# EAGLE design PCB0007_SW18AB (EAGLE 9.7.0)
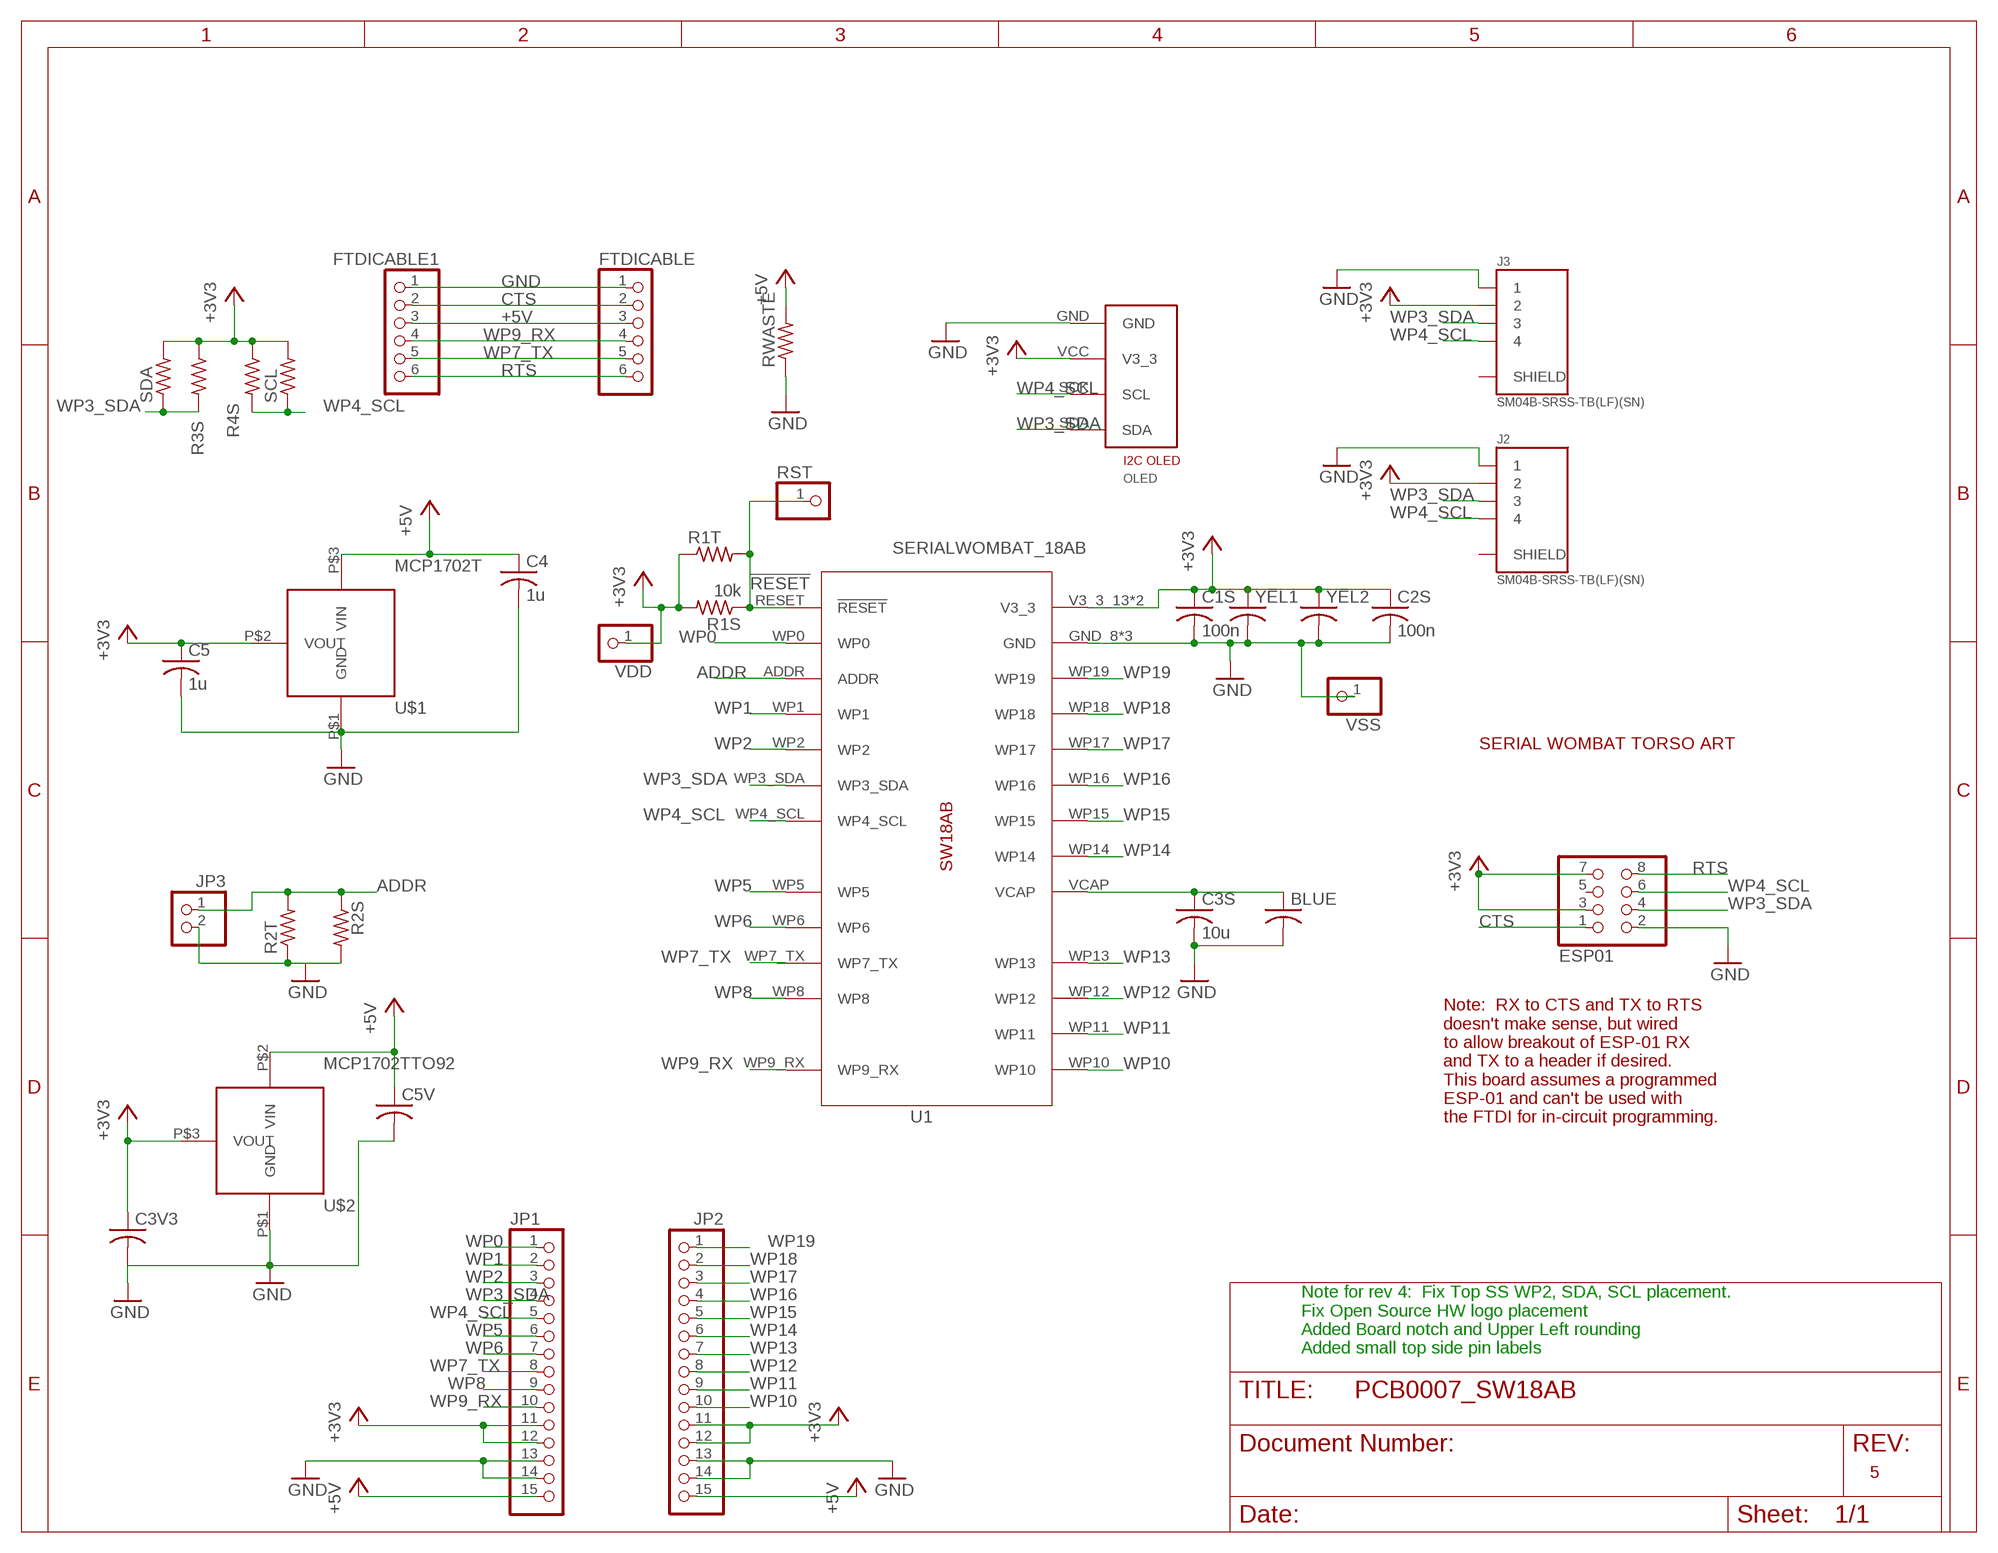
[diagram p0: schematic, sheet 1]

## Parts
BLUE  C-US025-030X050  [C025-030X050]
C1S  100n  C-USC0603  [C0603]
C2S  100n  C-USC0603  [C0603]
C3S  10u  C-USC0805  [C0805]
C3V3  C-US025-030X050  [C025-030X050]
C4  1u  C-USC0603  [C0603]
C5  1u  C-USC0603  [C0603]
C5V  C-US025-030X050  [C025-030X050]
ESP01  PINHD-2X4  [2X04]
FTDICABLE  PINHD-1X6  [1X06]
FTDICABLE1  PINHD-1X6  [1X06]
J2  SM04B-SRSS-TB(LF)(SN)  [JST_SM04B-SRSS-TB(LF)(SN)]
J3  SM04B-SRSS-TB(LF)(SN)  [JST_SM04B-SRSS-TB(LF)(SN)]
JP1  PINHD-1X15  [1X15]
JP2  PINHD-1X15  [1X15]
JP3  PINHD-1X2  [1X02]
OLED  OLED_I2C  [I2C_GND_VCC_SCL_SDA]
R1S  10k  R-US_R0603  [R0603]
R1T  R-US_0207/12  [0207/12]
R2S  R-US_R0603  [R0603]
R2T  R-US_0207/12  [0207/12]
R3S  R-US_R0603  [R0603]
R4S  R-US_R0603  [R0603]
RST  PINHD-1X1  [1X01]
RWASTE  R-US_R1206  [R1206]
SCL  R-US_0207/12  [0207/12]
SDA  R-US_0207/12  [0207/12]
U1  SERIALWOMBAT_18AB  [SW18AB_DIP]
U$1  MCP1702T  [SOT_23A_MICROCHIP]
U$2  MCP1702TTO92  [TO-92]
U$3  ART_SERIAL_WOMBAT_TORSO.33INHIGH  [ART_SERIAL_WOMBAT_TORSO_THIRDINCH]
VDD  PINHD-1X1  [1X01]
VSS  PINHD-1X1  [1X01]
YEL1  C-US025-030X050  [C025-030X050]
YEL2  C-US025-030X050  [C025-030X050]

## Nets
!RESET: R1S.1 R1T.2 RST.1 U1.RESET(!RESET)
+3V3: C1S.1 C2S.1 C3V3.1 C5.1 ESP01.3 ESP01.7 J2.2 J3.2 JP1.11 JP1.12 JP2.11 JP2.12 OLED.VCC(V3_3) R1S.2 R1T.1 R3S.1 R4S.1 SCL.2 SDA.2 U1.V3_3_13(V3_3) U1.V3_3_28(V3_3) U$1.P$2(VOUT) U$2.P$3(VOUT) VDD.1 YEL1.1 YEL2.1
+5V: C4.1 C5V.1 FTDICABLE1.3 FTDICABLE.3 JP1.15 JP2.15 RWASTE.2 U$1.P$3(VIN) U$2.P$2(VIN)
ADDR: JP3.1 R2S.1 R2T.2 U1.ADDR
CTS: ESP01.1 FTDICABLE1.2 FTDICABLE.2
GND: BLUE.2 C1S.2 C2S.2 C3S.2 C3V3.2 C4.2 C5.2 C5V.2 ESP01.2 FTDICABLE1.1 FTDICABLE.1 J2.1 J3.1 JP1.13 JP1.14 JP2.13 JP2.14 JP3.2 OLED.GND R2S.2 R2T.1 RWASTE.1 U1.G_19(GND) U1.G_27(GND) U1.GND_8(GND) U$1.P$1(GND) U$2.P$1(GND) VSS.1 YEL1.2 YEL2.2
N$1: BLUE.1 C3S.1 U1.VCAP
RTS: ESP01.8 FTDICABLE1.6 FTDICABLE.6
WP0: JP1.1 U1.WP0
WP1: JP1.2 U1.WP1
WP2: JP1.3 U1.WP2
WP3_SDA: ESP01.4 J2.3 J3.3 JP1.4 OLED.SDA R3S.2 SDA.1 U1.WP3_SDA
WP4_SCL: ESP01.6 J2.4 J3.4 JP1.5 OLED.SCK(SCL) R4S.2 SCL.1 U1.WP4_SCL
WP5: JP1.6 U1.WP5
WP6: JP1.7 U1.WP6
WP7_TX: FTDICABLE1.5 FTDICABLE.5 JP1.8 U1.WP7_TX
WP8: JP1.9 U1.WP8
WP9_RX: FTDICABLE1.4 FTDICABLE.4 JP1.10 U1.WP9_RX
WP10: JP2.10 U1.WP10
WP11: JP2.9 U1.WP11
WP12: JP2.8 U1.WP12
WP13: JP2.7 U1.WP13
WP14: JP2.6 U1.WP14
WP15: JP2.5 U1.WP15
WP16: JP2.4 U1.WP16
WP17: JP2.3 U1.WP17
WP18: JP2.2 U1.WP18
WP19: JP2.1 U1.WP19
Unconnected: ESP01.5 J2.S1(SHIELD) J2.S2(SHIELD) J3.S1(SHIELD) J3.S2(SHIELD)

## Notes on the sheet
- Note:  RX to CTS and TX to RTS 
  doesn't make sense, but wired 
  to allow breakout of ESP-01 RX 
  and TX to a header if desired.
  This board assumes a programmed
  ESP-01 and can't be used with
  the FTDI for in-circuit programming.
- Note for rev 4:  Fix Top SS WP2, SDA, SCL placement.  
  Fix Open Source HW logo placement
  Added Board notch and Upper Left rounding
  Added small top side pin labels
- 5

## Library data of the parts
BLUE C1S C2S C3S C3V3 C4 C5 C5V YEL1 YEL2 = rcl:C-US: CAPACITOR, American symbol; SPICEPREFIX: C
ESP01 = pinhead:PINHD-2X4: PIN HEADER
FTDICABLE FTDICABLE1 = pinhead:PINHD-1X6: PIN HEADER
J2 J3 = SerialWombat_F360_Library:SM04B-SRSS-TB(LF)(SN): SH Series 1.0 mm Pitch 2 Position Single Row Side Entry Shrouded Header; MANUFACTURER: JST; STANDARD: Manufacturer recommendations
JP1 JP2 = pinhead:PINHD-1X15: PIN HEADER
JP3 = pinhead:PINHD-1X2: PIN HEADER
OLED = JAB:OLED_I2C
R1S R1T R2S R2T R3S R4S RWASTE SCL SDA = rcl:R-US_: RESISTOR, American symbol; SPICEPREFIX: R
RST VDD VSS = pinhead:PINHD-1X1: PIN HEADER
U1 = SerialWombat_F360_Library:SERIALWOMBAT_18AB
U$1 U$2 = JAB:MCP1702T: The MCP1702 is a family of CMOS low dropout (LDO) voltage regulators that can deliver up to 250 mA of current while consuming only 2.0 μA of quiescent current (typical). The input operating range is specified from 2.7V to 13.2V, making it an ideal choice for two to six primary cell battery-powered applications, 9V alkaline and one or two cell Li-Ion-powered applications. The MCP1702 is capable of delivering 250 mA with only 625 mV (typical) of input to output voltage differential (VOUT = 2.8V). The output voltage tolerance of the MCP1702 is typically ±0.4% at +25°C and ±3% maximum over the operating junction temperature range of -40°C to +125°C. Line regulation is ±0.1% typical at +25°C. Output voltages available for the MCP1702 range from 1.2V to 5.0V. The LDO output is stable when using only 1 μF of output capacitance. Ceramic, tantalum or aluminum electrolytic capacitors can all be used for input and output. Overcurrent limit and overtemperature shutdown provide a robust solution for any application. Package options include the SOT-23A, SOT-89-3, and TO-92.
U$3 = SerialWombat_F360_Library:ART_SERIAL_WOMBAT_TORSO

## Board
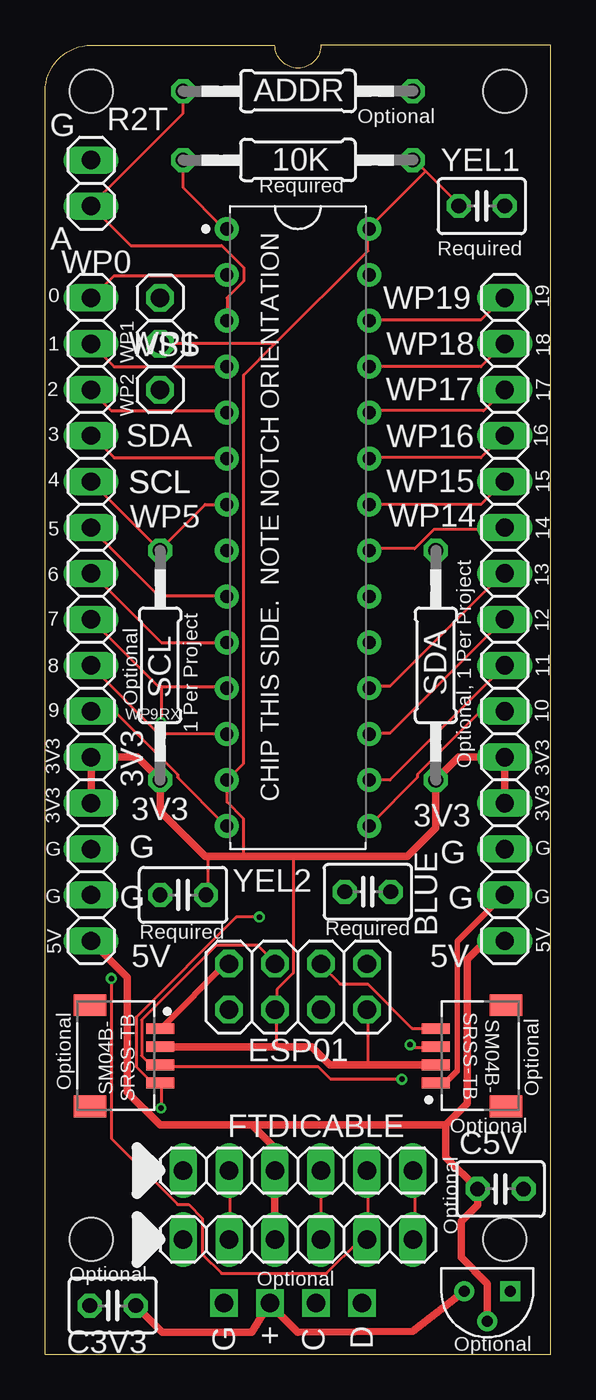
[diagram p1: board, top side]
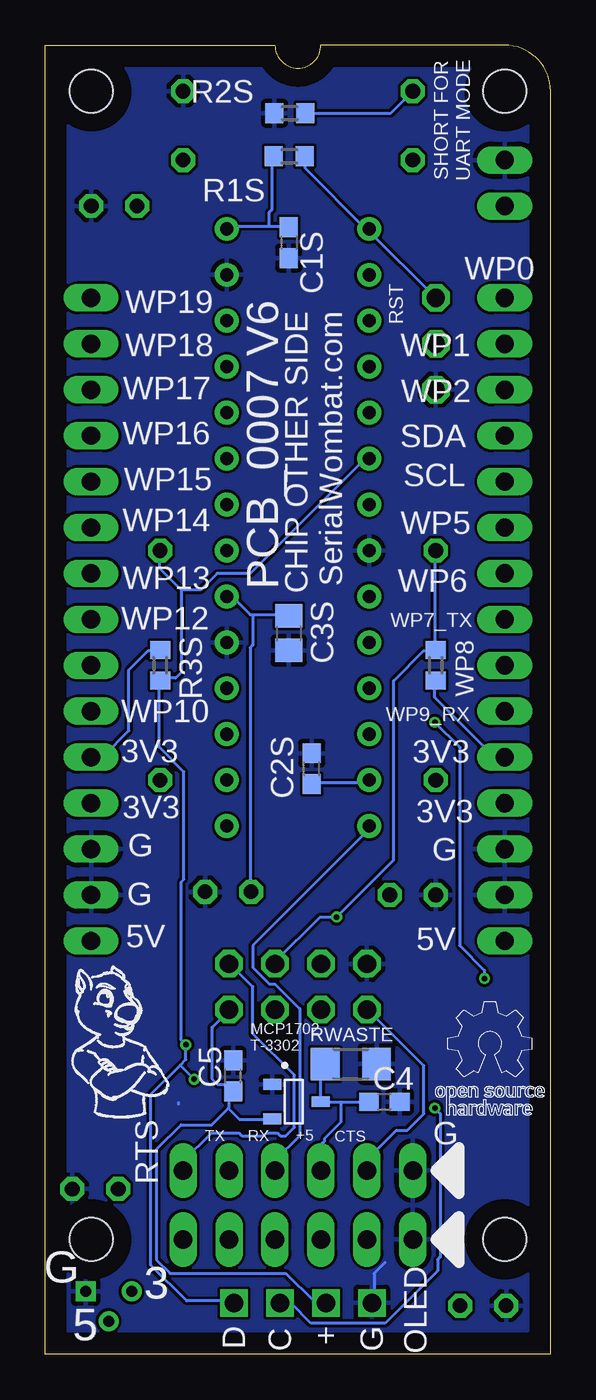
[diagram p2: board, bottom side, seen from below]

Size 27.94 x 72.39 mm. Coordinates in mm from the lower left corner, seen from the top.
Outline: 0,0 27.94,0 27.94,72.39 15.24,72.39 arc-180 12.7,72.39 2.54,72.39 arc90 0,69.85 0,0
Copper layers (1*16): Top 0.035mm / dielectric 1.5mm / Bottom 0.035mm
Design rules "Fusion Electronics Design Rules": minimum track width 6mil, minimum drill 0.3mm, track to track 6mil, track to pad 6mil, pad to pad 6mil, via to via 6mil, smd to smd 6mil, copper to edge 40mil, drill to drill 6mil, minimum pad ring 10mil, minimum via ring 6mil, stop-mask expansion 4mil, vias tented up to drill 0mil, thermal gap 10mil
Holes 2.38 mm at 2.54,69.85 25.4,69.85 25.4,6.35 2.54,6.35

### Footprints (pad centres in the part's own frame; a part is rotated, then mirrored left to right if it is on the bottom)
C025-030X050 = drill 0.813 octagon: 1 -1.27,0; 2 1.27,0
C0603 = smd 1.1 x 1: 1 -0.85,0; 2 0.85,0
C0805 = smd 1.3 x 1.5: 1 -0.95,0; 2 0.95,0
2X04 = drill 1.016 octagon: 1 -3.81,-1.27; 2 -3.81,1.27; 3 -1.27,-1.27; 4 -1.27,1.27; 5 1.27,-1.27; 6 1.27,1.27; 7 3.81,-1.27; 8 3.81,1.27
1X06 = drill 1.016 long: 1 -6.35,0; 2 -3.81,0; 3 -1.27,0; 4 1.27,0; 5 3.81,0; 6 6.35,0
JST_SM04B-SRSS-TB(LF)(SN) = smd 0.6 x 1.55: 1 -1.5,0; 2 -0.5,0; 3 0.5,0; 4 1.5,0 | smd 1.2 x 1.8: S1 -2.8,-3.875; S2 2.8,-3.875
1X15 = drill 1.016 long: 1 -17.78,0; 2 -15.24,0; 3 -12.7,0; 4 -10.16,0; 5 -7.62,0; 6 -5.08,0; 7 -2.54,0; 8 0,0; 9 2.54,0; 10 5.08,0; 11 7.62,0; 12 10.16,0; 13 12.7,0; 14 15.24,0; 15 17.78,0
1X02 = drill 1.016 long: 1 -1.27,0; 2 1.27,0
I2C_GND_VCC_SCL_SDA = drill 1.016 square: GND 3.81,0; SCK -1.27,0; SDA -3.81,0; VCC 1.27,0
R0603 = smd 1 x 1.1: 1 -0.85,0; 2 0.85,0
0207/12 = drill 0.813 octagon: 1 -6.35,0; 2 6.35,0
1X01 = drill 1.016 octagon: 1 0,0
R1206 = smd 1.6 x 1.803: 1 -1.422,0; 2 1.422,0
SW18AB_DIP = drill 0.723 pad 1.323: ADDR -3.937,11.43; G_19 3.937,-6.35; G_27 3.937,13.97; GND_8 -3.937,-1.27; RESET -3.937,16.51; V3_3_13 -3.937,-13.97; V3_3_28 3.937,16.51; VCAP 3.937,-3.81; WP0 -3.937,13.97; WP1 -3.937,8.89; WP2 -3.937,6.35; WP3_SDA -3.937,3.81; WP4_SCL -3.937,1.27; WP5 -3.937,-3.81; WP6 -3.937,-6.35; WP7_TX -3.937,-8.89; WP8 -3.937,-11.43; WP9_RX -3.937,-16.51; WP10 3.937,-16.51; WP11 3.937,-13.97; WP12 3.937,-11.43; WP13 3.937,-8.89; WP14 3.937,-1.27; WP15 3.937,1.27; WP16 3.937,3.81; WP17 3.937,6.35; WP18 3.937,8.89; WP19 3.937,11.43
SOT_23A_MICROCHIP = smd 0.6 x 1: P$1 -0.95,-2.7; P$2 0.95,-2.7; P$3 0,0
TO-92 = drill 0.6 square: P$1 1.27,0 | drill 0.6: P$2 0,-1.651; P$3 -1.27,0

### Placement (x,y rotation side)
BLUE  17.83,25.58 0 top
C1S  14.48,61.47 270 bottom
C2S  13.21,32.39 90 bottom
C3S  14.48,39.88 270 bottom
C3V3  3.73,2.69 180 top
C4  9.19,13.97 0 bottom
C5  17.55,15.39 90 bottom
C5V  25.17,9.14 0 top
ESP01  13.97,20.32 0 top
FTDICABLE  13.97,10.16 0 top
FTDICABLE1  13.97,6.35 0 top
J2  21.59,16.51 90 top
J3  6.35,16.51 270 top
JP1  2.54,40.64 270 top
JP2  25.4,40.64 270 top
JP3  2.54,64.77 90 top
OLED  13.69,2.84 180 top
R1S  14.45,66.24 180 bottom
R1T  13.97,66.04 180 top
R2S  14.43,68.63 180 bottom
R2T  13.97,69.85 180 top
R3S  21.59,38.1 270 bottom
R4S  6.35,38.1 90 bottom
RST  6.35,58.42 0 top
RWASTE  11.05,16.05 180 bottom
SCL  6.35,38.1 270 top
SDA  21.59,38.1 270 top
U1  13.97,45.72 0 top
U$1  12.7,13.97 270 bottom
U$2  24.43,3.48 0 top
U$3  24.13,16.51 0 bottom
VDD  6.35,55.88 0 top
VSS  6.35,53.34 0 top
YEL1  24.13,63.5 0 top
YEL2  7.62,25.4 180 top

### Tracks (layer width: path | path; a pad name or v marks a point on that pad's centre or on a via)
!RESET
  Top 0.152: R1T.2 7.62,64.52 9.91,62.23 U1.RESET
  Bottom 0.152: 10.16,62.23 10.21,62.23 13.56,65.58 13.56,66.19 R1S.1 | 10.16,62.23 RST.1 | 10.16,62.23 U1.RESET
+3V3
  Top 0.152: 12.8,17.01 12.8,18.95 ESP01.3 12.8,19.1 12.8,20.17 13.72,21.08 13.72,27.53 | 17.83,16.01 17.83,18.95 ESP01.7 | 21.03,65.43 22.86,63.6 YEL1.1 | 21.03,65.43 20.42,66.04 R1T.1 | 17.83,62.23 21.03,65.43 | YEL2.1 8.99,25.5 8.99,27.48 8.84,27.53 | 10.06,31.75 10.06,30.53 10.97,29.62 10.97,27.53 | 17.83,62.23 17.83,61.01 12.7,55.88 | 12.7,55.88 10.97,54.15 10.97,32.66 10.06,31.75 | 17.83,62.23 U1.V3_3_28 | 10.06,31.75 U1.V3_3_13 | 12.7,55.88 VDD.1
  Top 0.406: J3.2 12.8,17.01 14.74,17.01 15.74,16.01 17.83,16.01 J2.2 | JP1.12 JP1.11 5.08,33.02 SCL.2 6.35,30.02 8.84,27.53 10.97,27.53 13.72,27.53 20.02,27.53 21.59,29.11 SDA.2 22.86,33.02 JP2.11 JP2.12 | C3V3.1 6.48,1.22 11.43,1.22 OLED.VCC 12.42,2.77 13.97,1.22 20.32,1.27 U$2.P$3
  Bottom 0.152: 17.82,13.61 17.22,13.01 15.54,13.01 U$1.P$2 | ESP01.7 17.83,18.95 18.71,18.07 18.73,18.1 18.73,15.24 18.41,14.92 18.1,14.92 17.78,14.61 C5.1 17.78,14.29 17.78,13.65 17.82,13.61 | OLED.VCC 12.5,2.95 13.11,2.95 14.63,4.47 21.03,4.47 21.79,5.23 21.79,11.33 20.42,12.7 18.73,12.7 17.82,13.61 | 15.54,62.38 17.68,62.38 17.83,62.23 U1.V3_3_28 | 15.54,62.38 14.48,62.38 C1S.1 | 15.54,62.38 15.54,63.14 15.39,63.3 15.39,66.19 R1S.2 | C2S.1 13.11,31.6 10.21,31.6 10.06,31.75 U1.V3_3_13 | R4S.1 6.4,37.24 6.4,36.32 3.2,33.12 2.59,33.12 JP1.11 | R3S.1 21.64,38.91 22.25,38.91 23.32,37.85 23.32,34.49 24.69,33.12 25.3,33.12 JP2.11
+5V
  Top 0.406: JP1.15 4.55,20.85 4.55,14.48 6.35,12.68 11.43,12.68 | 11.43,12.68 12.7,11.41 FTDICABLE.3 FTDICABLE1.3 | 11.43,12.68 22.15,12.68 | JP2.15 24.36,22.86 23.34,21.84 23.34,13.87 22.15,12.68 | 22.15,12.68 22.15,10.9 C5V.1 23.9,8.26 22.99,7.35 22.99,5.35 24.43,3.91 U$2.P$2
  Bottom 0.152: 11.58,13.92 10.06,13.92 C4.1 | 11.58,13.92 12.65,13.92 U$1.P$3 12.7,15.88 RWASTE.2 | 11.58,13.92 11.58,12.85 12.5,11.94 12.5,11.79 12.65,11.63 12.65,10.26 FTDICABLE.3
ADDR
  Top 0.152: U1.ADDR 10.06,57.2 10.06,58.42 10.97,59.33 10.97,60.1 9.75,61.32 4.72,61.32 JP3.1 2.59,63.6 7.62,68.63 R2T.2
  Bottom 0.152: R2S.1 8.84,68.63 R2T.2
CTS
  Top 0.152: FTDICABLE1.2 10.21,6.45 10.21,10.11 FTDICABLE.2
  Bottom 0.152: ESP01.1 10.11,19.05 7.01,15.95 7.01,13.31 7.92,12.4 8.53,12.4 10.06,10.87 10.06,10.26 FTDICABLE.2
GND
  Top 0.152: 6.4,18.03 J3.1 | 10.06,21.69 ESP01.2 | 22.25,15.14 21.64,15.14 J2.1 | 25.3,25.35 JP2.14
  Top 0.305: 10.06,21.69 6.4,18.03 | 22.25,15.14 22.78,15.67 22.78,22.84 25.3,25.35
  Bottom 0.152: 9.14,5.08 9.75,4.47 9.75,2.95 OLED.GND | 20.57,13.92 20.59,13.84
  pour Bottom: 1.27,1.27 26.67,1.27 26.67,71.12 1.27,71.12
N$1
  Bottom 0.152: 16.46,40.89 16.61,40.89 17.53,41.81 17.83,41.81 U1.VCAP | 16.46,40.89 14.48,40.89 C3S.1 | 16.46,40.89 16.46,39.22 16.61,39.06 16.61,25.65 BLUE.1
RTS
  Top 0.152: FTDICABLE1.6 20.42,6.45 20.42,10.11 FTDICABLE.6
  Bottom 0.152: ESP01.8 17.68,21.54 16.46,20.32 16.46,17.73 14.17,15.44 14.17,12.55 14.63,12.09 14.94,12.09 15.09,12.24 15.7,12.24 15.85,12.09 17.07,12.09 17.22,12.24 18.75,12.24 20.27,10.72 20.27,10.26 FTDICABLE.6
WP0
  Top 0.152: U1.WP0 9.91,59.64 3.81,59.64 2.59,58.42 JP1.1
WP1
  Top 0.152: U1.WP1 3.81,54.61 JP1.2
WP2
  Top 0.152: U1.WP2 9.91,52.17 3.66,52.17 2.59,53.24 JP1.3
WP3_SDA  (via drill 0.3)
  Top 0.152: U1.WP3_SDA 9.91,49.58 3.81,49.58 2.59,50.8 JP1.4 | ESP01.4 12.65,21.69 11.73,22.61 9.45,22.61 5.33,18.49 5.33,16.51 5.79,16.05 6.25,16.05 J3.3 6.4,15.9 15.09,15.9 15.77,15.22 v19.71,15.22 | v20.17,17.12 20.32,16.97 21.49,16.97 J2.3
  Bottom 0.152: 20.42,42.27 20.42,37.69 20.73,37.39 21.49,37.39 R3S.2 21.64,37.24 21.64,33.58 20.27,32.21 20.27,26.26 20.42,26.11 20.42,17.37 v20.17,17.12 20.17,16.31 20.48,15.99 | 20.42,42.27 21.64,43.48 21.64,44.4 SDA.1 | 20.42,42.27 19.36,42.27 18.44,43.18 16.61,43.18 10.36,49.43 10.06,49.43 U1.WP3_SDA | 20.48,15.99 22.1,14.38 22.1,4.93 20.12,2.95 17.53,2.95 OLED.SDA | 20.48,15.99 v19.71,15.22
WP4_SCL  (via drill 0.3)
  Top 0.152: U1.WP4_SCL 8.84,46.99 6.4,44.55 SCL.1 JP1.5 | v11.84,24.18 10.57,24.18 5.03,18.64 5.03,15.9 5.79,15.14 6.25,15.14 J3.4 6.4,14.99 v6.4,13.61 | J2.4 21.49,18.03 20.27,18.03 17.83,20.47 16.31,20.47 15.24,21.54 ESP01.6
  Bottom 0.152: SCL.1 6.4,44.4 6.4,39.06 R4S.2 6.4,38.91 7.01,38.91 8.69,37.24 8.69,27.33 v11.84,24.18 12.75,24.18 15.24,21.69 ESP01.6 | v6.4,13.61 6.1,13.31 6.1,5.39 6.25,5.23 6.25,4.62 9.14,1.73 13.26,1.73 14.33,2.79 14.94,2.79 OLED.SCK
WP5
  Top 0.152: U1.WP5 9.91,41.96 6.25,41.96 2.59,45.62 JP1.6
WP6
  Top 0.152: U1.WP6 6.4,39.37 2.59,43.18 JP1.7
WP7_TX  (via drill 0.3)
  Top 0.152: FTDICABLE.5 17.83,10.11 17.83,6.45 FTDICABLE1.5 17.68,6.3 17.37,6.3 15.54,4.47 9.75,4.47 8.69,5.54 8.69,7.52 7.92,8.28 7.32,8.28 3.66,11.94 v3.66,20.78 | 6.4,36.93 6.25,36.93 JP1.8 | 6.4,36.93 9.91,36.93 U1.WP7_TX | 6.4,36.93 v6.4,34.95
  Bottom 0.152: v3.66,20.78 3.66,21.23 5.03,22.61 5.03,33.58 v6.4,34.95
WP8
  Top 0.152: U1.WP8 9.91,34.34 6.25,34.34 2.59,38 JP1.9
WP9_RX
  Top 0.152: FTDICABLE.4 FTDICABLE1.4 | JP1.10 3.81,35.56 7.32,32.05 7.32,31.9 9.91,29.31 U1.WP9_RX
  Bottom 0.152: FTDICABLE.4 15.24,10.72 13.87,12.09 13.87,19.1 15.24,20.47 15.54,20.47 16.46,21.39 16.46,22.61 9.91,29.16 U1.WP9_RX
WP10
  Top 0.152: JP2.10 24.08,35.56 20.57,32.05 20.57,31.9 17.98,29.31 U1.WP10
WP11
  Top 0.152: U1.WP11 19.05,31.75 JP2.9
WP12
  Top 0.152: U1.WP12 17.98,34.34 19.05,34.34 25.3,40.59 JP2.8
WP13
  Top 0.152: U1.WP13 17.98,36.93 19.05,36.93 25.3,43.18 JP2.7
WP14
  Top 0.152: U1.WP14 17.98,44.55 20.42,44.55 21.49,45.62 25.3,45.62 JP2.6
WP15
  Top 0.152: U1.WP15 24.08,46.99 25.3,48.21 JP2.5
WP16
  Top 0.152: U1.WP16 17.98,49.58 24.08,49.58 25.3,50.8 JP2.4
WP17
  Top 0.152: JP2.3 24.23,52.17 17.98,52.17 U1.WP17
WP18
  Top 0.152: U1.WP18 24.08,54.61 25.3,55.83 JP2.2
WP19
  Top 0.152: U1.WP19 17.98,57.2 24.08,57.2 25.3,58.42 JP2.1

### Text on the board
tPlace: ADDR | Optional | G | 10K | Required | A | WP0 | Required | 0 | WP19 | 19 | 1 | WP1 | WP18 | 18 | WP1 | 2 | WP17 | 17 | WP2 | 3 | SDA | WP16 | 16 | 4 | SCL | SCL | WP15 | 15 | 5 | WP5 | WP14 | 14 | 6 | 13 | 7 | 12 | Optional | Optional, 1 Per Project | 8 | 1 Per Project | 11 | 9 | WP9RX | 10 | 3V3 | 3V3 | 3V3 | CHIP THIS SIDE. NOTE NOTCH ORIENTATION | 3V3 | 3V3 | 3V3 | 3V3 | G | G | G | G | G | G | G | G | 5V | Required | Required | 5V | 5V | 5V | Optional | SM04B- / SRSS-TB | SM04B- / SRSS-TB | Optional | Optional | Optional | Optional | Optional | Optional
bPlace: WP0 | PCB_0007 V6 | CHIP OTHER SIDE / SerialWombat.com | WP19 | WP1 | WP18 | WP2 | WP17 | SDA | WP16 | SCL | WP15 | WP5 | WP14 | WP6 | WP13 | WP7_TX | WP12 | WP8 | WP9_RX | WP10 | 3V3 | 3V3 | 3V3 | 3V3 | G | G | G | 5V | 5V | MCP1702 / T-3302 | RTS | G | CTS | +5 | RX | TX | 3 | G | 5
bNames: SHORT FOR / UART MODE